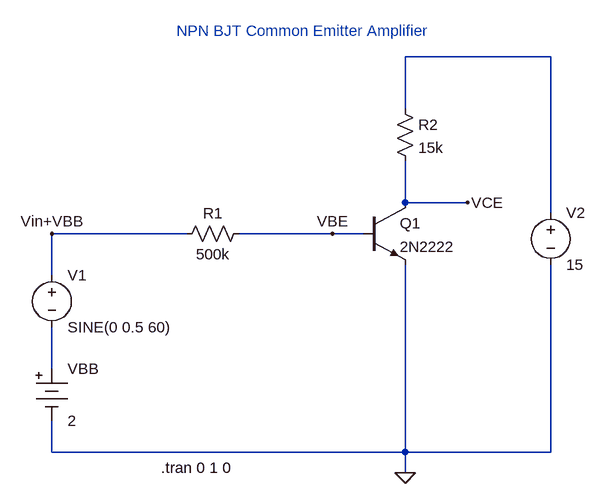
[diagram p0: schematic 2EEB_VELASCO_EXPT6_CKT2.asc]
2EEB_VELASCO_EXPT6_CKT2.asc, the LTspice schematic file:
Version 4
SHEET 1 880 680
WIRE 688 -272 464 -272
WIRE 464 -192 464 -272
WIRE 464 -48 464 -112
WIRE 560 -48 464 -48
WIRE 688 -32 688 -272
WIRE 128 0 -80 0
WIRE 352 0 208 0
WIRE 400 0 352 0
WIRE -80 64 -80 0
WIRE -80 208 -80 144
WIRE -80 336 -80 288
WIRE 464 336 464 48
WIRE 464 336 -80 336
WIRE 688 336 688 48
WIRE 688 336 464 336
WIRE 464 368 464 336
FLAG 464 368 0
FLAG -80 0 Vin+VBB
FLAG 352 0 VBE
FLAG 560 -48 VCE
SYMBOL Misc\\battery -80 192 R0
SYMATTR InstName VBB
SYMATTR Value 2
SYMBOL res 224 -16 R90
WINDOW 0 0 56 VBottom 2
WINDOW 3 32 56 VTop 2
SYMATTR InstName R1
SYMATTR Value 500k
SYMBOL npn 400 -48 R0
SYMATTR InstName Q1
SYMATTR Value 2N2222
SYMBOL res 448 -208 R0
SYMATTR InstName R2
SYMATTR Value 15k
SYMBOL voltage 688 -48 R0
SYMATTR InstName V2
SYMATTR Value 15
SYMBOL voltage -80 48 R0
SYMATTR InstName V1
SYMATTR Value SINE(0 0.5 60)
TEXT 88 360 Left 2 !.tran 0 1 0
TEXT 112 -312 Left 2 ;NPN BJT Common Emitter Amplifier

The netlist it stands for:
* 2EEB_VELASCO_EXPT6_CKT2.asc
VBB N002 0 2
R1 VBE Vin+VBB 500k
Q1 VCE VBE 0 0 2N2222
R2 N001 VCE 15k
V2 N001 0 15
V1 Vin+VBB N002 SINE(0 0.5 60)
.model NPN NPN
.model PNP PNP
.lib standard.bjt
.tran 0 1 0
* NPN BJT Common Emitter Amplifier
.backanno
.end